# Altium schematic sheet ESP-WROOM-32.SchDoc
size A4
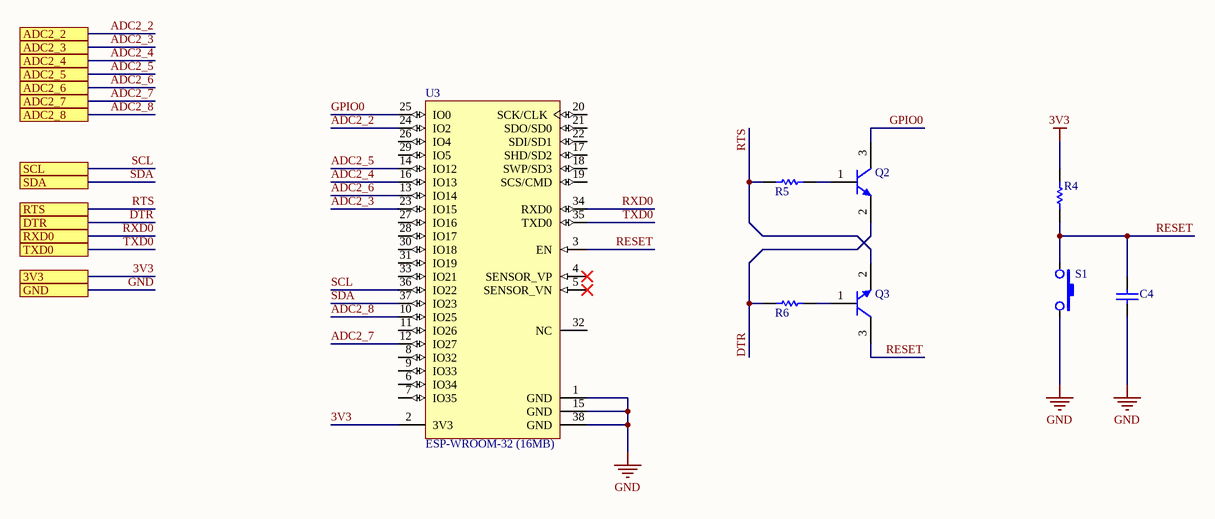
[diagram p0: ESP-WROOM-32.SchDoc]

## Parts
C4  C0805C105K4RAC7800  [CAPC2013X145X50NL20T25]  (value not drawn)
Q2  MMBT2222ALT1G  [ONSC-SOT-23-3-318-08_V]  (value not drawn)
Q3  MMBT2222ALT1G  [ONSC-SOT-23-3-318-08_V]  (value not drawn)
R4  RK73B2ATTD103J  [RESC2013X60X30NL20T20]  (value not drawn)
R5  RK73B2ATTD103J  [RESC2013X60X30NL20T20]  (value not drawn)
R6  RK73B2ATTD103J  [RESC2013X60X30NL20T20]  (value not drawn)
S1  PTS820J25MSMTRLFS  [SMT_SW_PTS_820]  (value not drawn)
U3  ESP-WROOM-32 (16MB)  [OLMX-ESP-WROOM-32]

## Ports
3V3, ADC2_2, ADC2_3, ADC2_4, ADC2_5, ADC2_6, ADC2_7, ADC2_8, DTR, GND, RTS, RXD0, SCL, SDA, TXD0

## Nets
3V3: R4.2 U3.2(3V3) ; port 3V3
GND: C4.1 S1.2 U3.1(GND) U3.15(GND) U3.38(GND) ; port GND
ADC2_2: U3.24(IO2) ; port ADC2_2
ADC2_3: U3.23(IO15) ; port ADC2_3
ADC2_4: U3.16(IO13) ; port ADC2_4
ADC2_5: U3.14(IO12) ; port ADC2_5
ADC2_6: U3.13(IO14) ; port ADC2_6
ADC2_7: U3.12(IO27) ; port ADC2_7
ADC2_8: U3.10(IO25) ; port ADC2_8
DTR: Q2.2(E) R6.2 ; port DTR
GPIO0: Q2.3(C) U3.25(IO0)
RESET: C4.2 Q3.3(C) R4.1 S1.1 U3.3(EN)
RTS: Q3.2(E) R5.2 ; port RTS
RXD0: U3.34(RXD0) ; port RXD0
SCL: U3.36(IO22) ; port SCL
SDA: U3.37(IO23) ; port SDA
TXD0: U3.35(TXD0) ; port TXD0
NetQ2_1: Q2.1(B) R5.1
NetQ3_1: Q3.1(B) R6.1

Not connected (* = marked no-connect by the designer): U3 4(SENSOR_VP)* 5(SENSOR_VN)* 6(IO34) 7(IO35) 8(IO32) 9(IO33) 11(IO26) 17(SHD/SD2) 18(SWP/SD3) 19(SCS/CMD) 20(SCK/CLK) 21(SDO/SD0) 22(SDI/SD1) 26(IO4) 27(IO16) 28(IO17) 29(IO5) 30(IO18) 31(IO19) 32(NC) 33(IO21)

## Library data of the parts
C4 = CMP-2007-01082-1: 1µF ±10% 16V Ceramic Capacitor X7R 0805 (2012 Metric); Manufacturer: Kemet; Part Number: C0805C105K4RAC7800
Q2 Q3 = CMP-1048-00538-1: General Purpose Transistor, NPN Silicon, 3-Pin SOT-23, Pb-Free, Tape and Reel; Manufacturer: On Semiconductor; fT Min (MHz): 300; IC Continuous (A): 0.6; ComponentLink3URL: http://www.onsemi.cn/pub_link/Collateral/318-08.PDF; PartNumber: MMBT2222ALT1G; RoHS: TRUE; ComponentLink1URL: http://www.onsemi.com/; ComponentLink3Description: Package Specification; ComponentLink2Description: Datasheet; Mounting Technology: Surface Mount; Packing: Tape and Reel; PackageDescription: 3-Pin Small Outline Transistor, Body 2.92 x 1.3 mm, Pitch 0.95 mm; DatasheetVersion: Rev. 10; PackageReference: SOT-23-3-318-08; ComponentLink2URL: http://www.onsemi.cn/pub_link/Collateral/MMBT2222LT1-D.PDF; Polarity: NPN; PackageVersion: Rev. AP, 11/2009; ComponentLink1Description: Manufacturer URL
R4-R6 = CMP-2001-04657-1: 10 kOhms ±5% 0.25W, 1/4W Chip Resistor 0805 (2012 Metric) Automotive AEC-Q200, Moisture Resistant Thick Film; Manufacturer: KOA Speer; Part Number: RK73B2ATTD103J
S1 = PTS820J25MSMTRLFS: Tactile Switch SPST-NO Top Actuated Surface Moun
U3 = CMP-2000-07454-1: Espressif System, 2.7 to 3.6 V, -40 to 85 degC, 38-Pin SMD; Package Description: 38-Pin Surface Mount Device, Body 18 x 25.5 mm, Pitch 1.27 mm; RoHSCompliant: false; Mounting Technology: SurfaceMount; Package Reference: ESP-WROOM-32 (16MB)